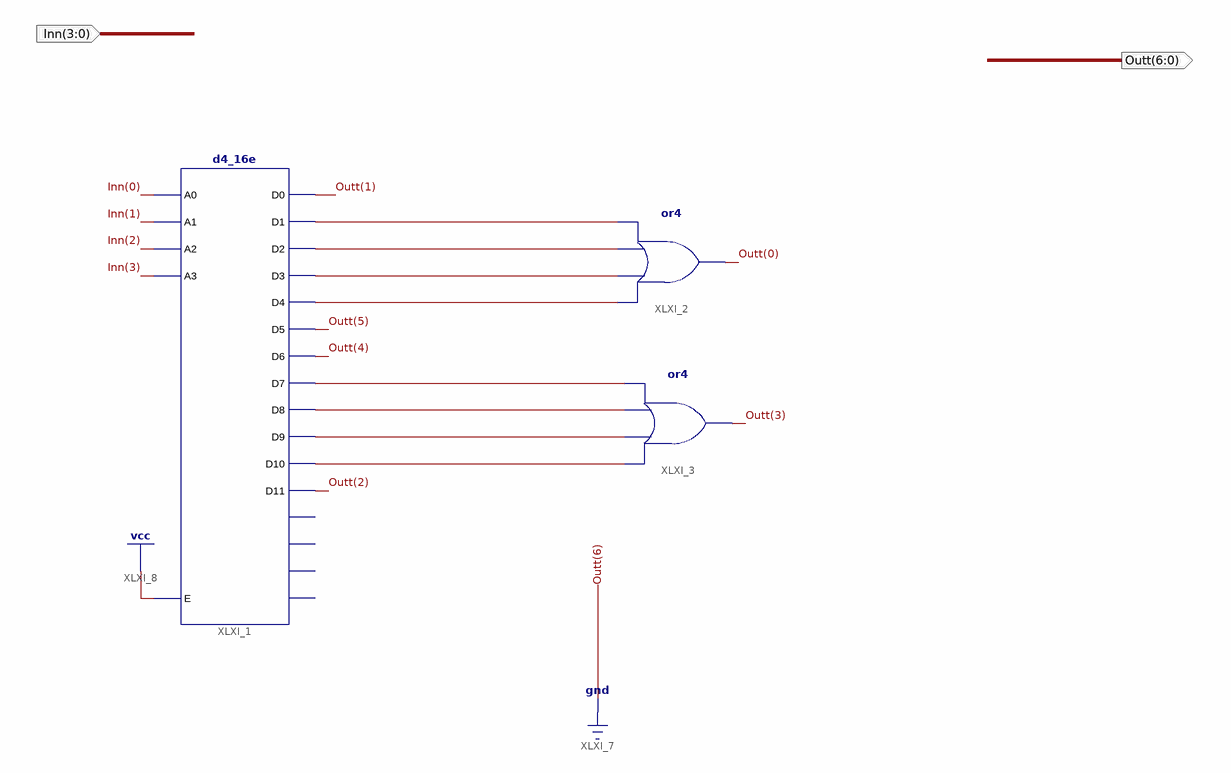
[diagram p0: schematic sheet 1]
// Xilinx ISE schematic loopSeg.sch (spartan6) as structural Verilog: 3 symbols, 2 ports
module loopSeg (
  input  [3:0] Inn,
  output [6:0] Outt
);

  wire XLXN_17, XLXN_18, XLXN_19, XLXN_20, XLXN_21, XLXN_22, XLXN_23, XLXN_24;

  d4_16e XLXI_1 (
    .A0(Inn[0]), .A1(Inn[1]), .A2(Inn[2]), .A3(Inn[3]), .E(1'b1), .D0(Outt[1]), .D1(XLXN_17), .D10(XLXN_24),
    .D11(Outt[2]), .D2(XLXN_18), .D3(XLXN_19), .D4(XLXN_20), .D5(Outt[5]), .D6(Outt[4]), .D7(XLXN_21),
    .D8(XLXN_22), .D9(XLXN_23));  // open: D12, D13, D14, D15
  or XLXI_2 (Outt[0], XLXN_20, XLXN_19, XLXN_18, XLXN_17);
  or XLXI_3 (Outt[3], XLXN_24, XLXN_23, XLXN_22, XLXN_21);

  assign Outt[6] = 1'b0;
endmodule
